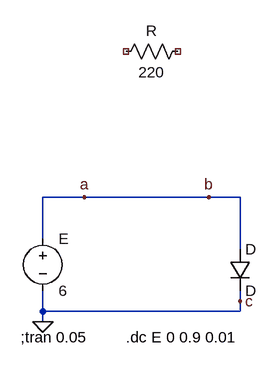
[diagram p0: schematic Draft3.asc]
Draft3.asc, the LTspice schematic file:
Version 4
SHEET 1 880 680
WIRE 112 80 48 80
WIRE 304 80 112 80
WIRE 352 80 304 80
WIRE 48 144 48 80
WIRE 352 160 352 80
WIRE 352 240 352 224
WIRE 48 256 48 224
WIRE 352 256 352 240
WIRE 352 256 48 256
WIRE 48 272 48 256
FLAG 112 80 a
FLAG 304 80 b
FLAG 352 240 c
FLAG 48 272 0
SYMBOL voltage 48 128 R0
WINDOW 123 0 0 Left 0
WINDOW 39 0 0 Left 0
SYMATTR InstName E
SYMATTR Value 6
SYMBOL res 272 -160 R90
WINDOW 0 0 56 VBottom 2
WINDOW 3 32 56 VTop 2
SYMATTR InstName R
SYMATTR Value 220
SYMATTR SpiceLine tol=1 pwr=0.1
SYMBOL diode 336 160 R0
SYMATTR InstName D
TEXT 14 296 Left 2 !;tran 0.05
TEXT 176 296 Left 2 !.dc E 0 0.9 0.01

The netlist it stands for:
* Draft3.asc
V§E b 0 6
R NC_01 NC_02 220 tol=1 pwr=0.1
D b 0 D
.model D D
.lib standard.dio
;tran 0.05
.dc E 0 0.9 0.01
.backanno
.end